# EAGLE design DRV8323RH (EAGLE 9.6.2)
AUTHOR: LYLES, LUNA, CARBAUGH; BOARD_NAME: BLDC Motor Driver; DOC_NUM: 1; PROJECT_NAME: Balancing Cube; REVISION: 2
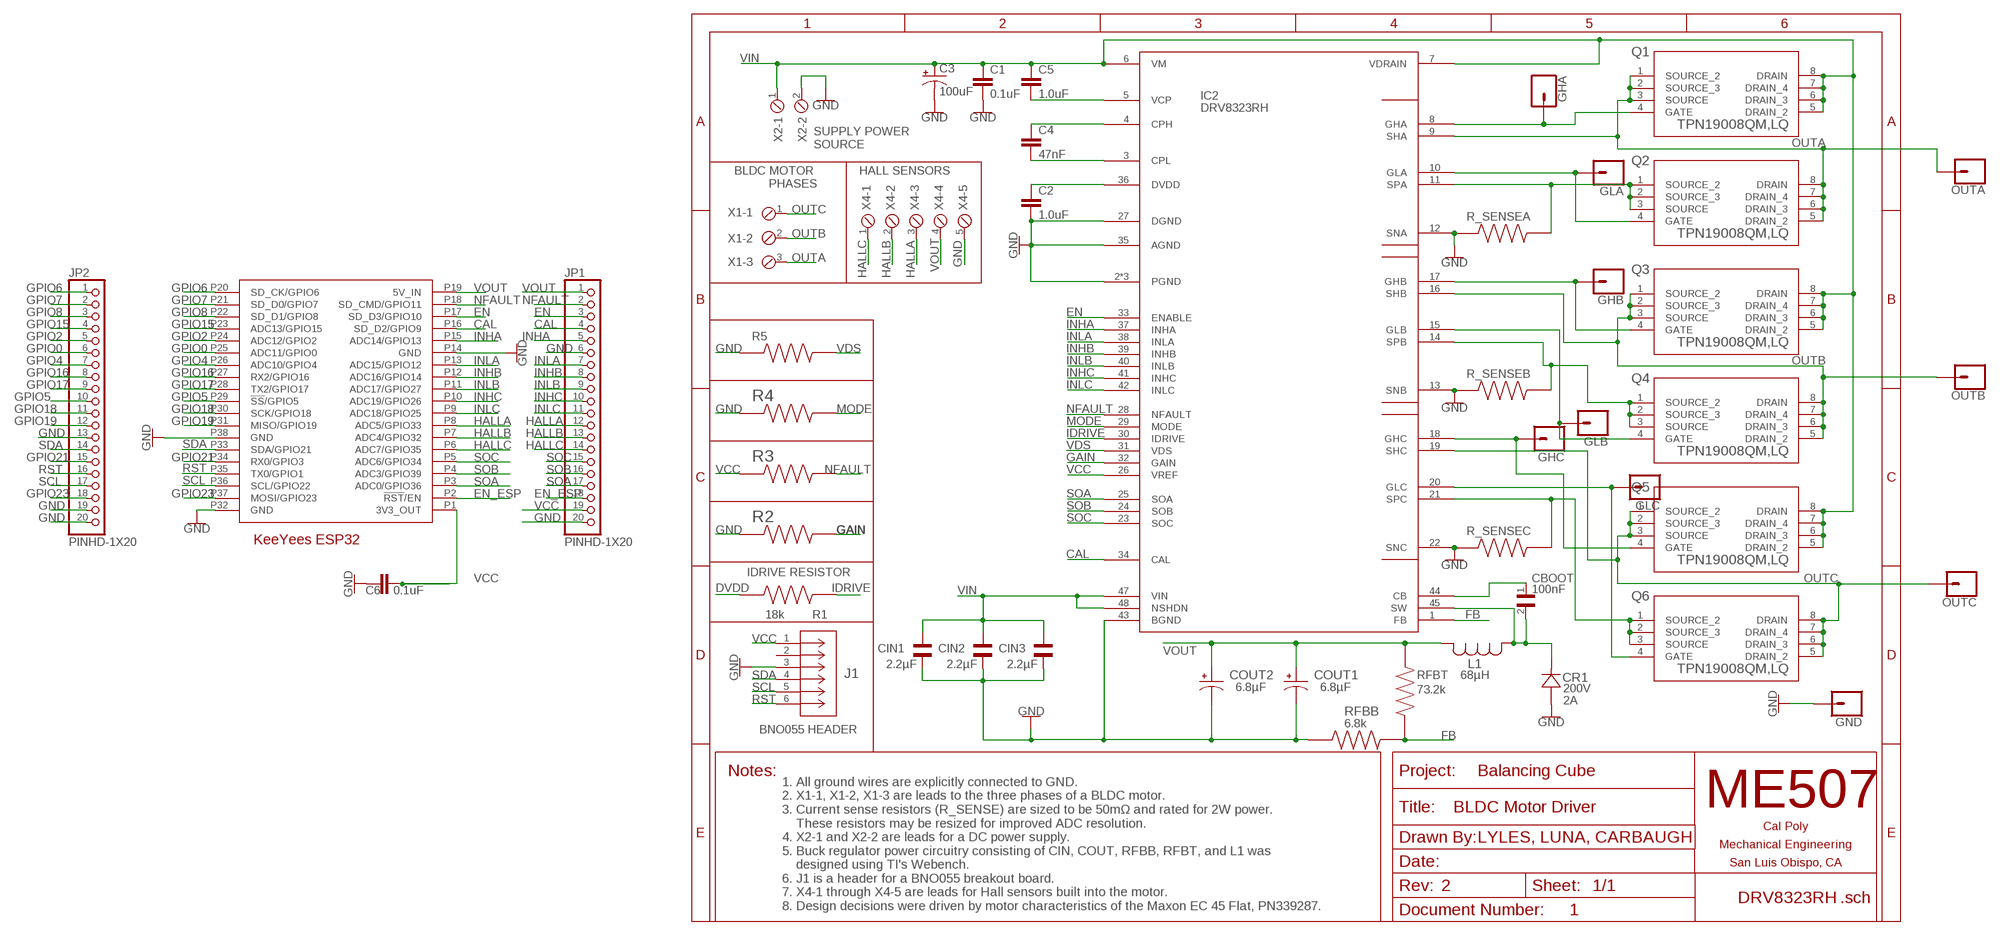
[diagram p0: schematic, sheet 1]

## Parts
C1  0.1uF  0.1UF-0603-50V-10%-X7R-WE  [0603]
C2  1.0uF  1.0UF-0805-25V-10%  [0805]
C3  100uF  100UF-POLAR-RADIAL-2.5MM-25V-20%  [CPOL-RADIAL-2.5MM-6.5MM]
C4  47nF  47NF-0603-25V-5%  [0603]
C5  1.0uF  1.0UF-0805-25V-10%  [0805]
C6  0.1uF  0.1UF-0603-50V-10%-X7R-WE  [0603]
CBOOT  C2012X7R2A104K125AA  [CAPC2012X145N]
CIN1  C3225X7R2A225K230AB  [CAP_C3225X7R2A225K230AB]
CIN2  C3225X7R2A225K230AB  [CAP_C3225X7R2A225K230AB]
CIN3  C3225X7R2A225K230AB  [CAP_C3225X7R2A225K230AB]
COUT1  TPSD685K050R0600  [CAPPM7343X310N]
COUT2  TPSD685K050R0600  [CAPPM7343X310N]
CR1  SK220ATRDIODE_SK220ATR_SMC-L  [DIODE_SK220ATR_SMC-L]
GHA  CONN_01_1MM  [1X01_1MM_NO_SILK]
GHB  CONN_01_1MM  [1X01_1MM_NO_SILK]
GHC  CONN_01_1MM  [1X01_1MM_NO_SILK]
GLA  CONN_01_1MM  [1X01_1MM_NO_SILK]
GLB  CONN_01_1MM  [1X01_1MM_NO_SILK]
GLC  CONN_01_1MM  [1X01_1MM_NO_SILK]
GND  CONN_01_1MM  [1X01_1MM_NO_SILK]
IC2  DRV8323RH  [QFN50P700X700X100-49T515]
J1  PPTC061LFBN-RCCONN6_061LFBN-RC_SUL  [CONN6_061LFBN-RC_SUL]
JP1  PINHD-1X20  [1X20]
JP2  PINHD-1X20  [1X20]
L1  SRR1210-680MIND_BOURNS_SRR1210  [IND_BOURNS_SRR1210]
OUTA  CONN_01_1MM  [1X01_1MM_NO_SILK]
OUTB  CONN_01_1MM  [1X01_1MM_NO_SILK]
OUTC  CONN_01_1MM  [1X01_1MM_NO_SILK]
Q1  TPN19008QM,LQ  [TSON_ADVANCE_TOS]
Q2  TPN19008QM,LQ  [TSON_ADVANCE_TOS]
Q3  TPN19008QM,LQ  [TSON_ADVANCE_TOS]
Q4  TPN19008QM,LQ  [TSON_ADVANCE_TOS]
Q5  TPN19008QM,LQ  [TSON_ADVANCE_TOS]
Q6  TPN19008QM,LQ  [TSON_ADVANCE_TOS]
R1  ERJP06J183V  [RES_ERJP06J183V]
R2  RMCF0805JT750K  [RESC2012X65N]
R3  RC0805JR-0710KP  [RESC2012X60N]
R4  RNCF0805DTE47K0  [RESC2012X65N]
R5  ERJP06J183V  [RES_ERJP06J183V]
R_SENSEA  CRM2512-FX-R300ELF  [RESC6331X80N]
R_SENSEB  CRM2512-FX-R300ELF  [RESC6331X80N]
R_SENSEC  CRM2512-FX-R300ELF  [RESC6331X80N]
RFBB  RC1206FR-076K8L  [RESC3116X65N]
RFBT  RR1220P-7322-D-M  [RESC2012X50N]
U$1  KEEYEES_ESP32EXT  [KEEYEES_ESP32_EXTENDED]
X1  SCREWTERM_3P_508  [3POL508]
X2  SCREWTERM_2P_508  [2POL508]
X4  SCREWTERM_5P_508  [5POL508]

## Nets
CAL: IC2.34(CAL) JP1.4 U$1.P16(SD_D2/GPIO9)
DVDD: C2.1 IC2.36(DVDD) R1.1
EN: IC2.33(ENABLE) JP1.3 U$1.P17(SD_D3/GPIO10)
EN_ESP: JP1.18 U$1.P2(!RST!/EN)
FB: IC2.1(FB) RFBB.2 RFBT.1
GAIN: IC2.32(GAIN) R2.2
GHA: GHA.1 IC2.8(GHA) Q1.4(GATE)
GHB: GHB.1 IC2.17(GHB) Q3.4(GATE)
GHC: GHC.1 IC2.18(GHC) Q5.4(GATE)
GLA: GLA.1 IC2.10(GLA) Q2.4(GATE)
GLB: GLB.1 IC2.15(GLB) Q4.4(GATE)
GLC: GLC.1 IC2.20(GLC) Q6.4(GATE)
GND: C1.2 C2.2 C3.2(-) C6.2 CIN1.1 CIN2.1 CIN3.1 COUT1.2 COUT2.2 CR1.2 GND.1 IC2.2(PGND) IC2.12(SNA) IC2.13(SNB) IC2.22(SNC) IC2.27(DGND) IC2.35(AGND) IC2.43(BGND) IC2.46(PGND) IC2.49(PGND) J1.3 JP1.6 JP1.20 JP2.13 JP2.19 JP2.20 R2.1 R4.1 R5.1 R_SENSEA.1 R_SENSEB.1 R_SENSEC.1 RFBB.1 U$1.P14(GND) U$1.P32(GND) U$1.P38(GND) X2.2 X4.5
GPIO0: JP2.6 U$1.P25(ADC11/GPIO0)
GPIO2: JP2.5 U$1.P24(ADC12/GPIO2)
GPIO4: JP2.7 U$1.P26(ADC10/GPIO4)
GPIO5: JP2.10 U$1.P29(!SS!/GPIO5)
GPIO6: JP2.1 U$1.P20(SD_CK/GPIO6)
GPIO7: JP2.2 U$1.P21(SD_D0/GPIO7)
GPIO8: JP2.3 U$1.P22(SD_D1/GPIO8)
GPIO15: JP2.4 U$1.P23(ADC13/GPIO15)
GPIO16: JP2.8 U$1.P27(RX2/GPIO16)
GPIO17: JP2.9 U$1.P28(TX2/GPIO17)
GPIO18: JP2.11 U$1.P30(SCK/GPIO18)
GPIO19: JP2.12 U$1.P31(MISO/GPIO19)
GPIO21: JP2.15 U$1.P34(RX0/GPIO3)
GPIO23: JP2.18 U$1.P37(MOSI/GPIO23)
HALLA: JP1.12 U$1.P8(ADC5/GPIO33) X4.3
HALLB: JP1.13 U$1.P7(ADC4/GPIO32) X4.2
HALLC: JP1.14 U$1.P6(ADC7/GPIO35) X4.1
IDRIVE: IC2.30(IDRIVE) R1.2
INHA: IC2.37(INHA) JP1.5 U$1.P15(ADC14/GPIO13)
INHB: IC2.39(INHB) JP1.8 U$1.P12(ADC16/GPIO14)
INHC: IC2.41(INHC) JP1.10 U$1.P10(ADC19/GPIO26)
INLA: IC2.38(INLA) JP1.7 U$1.P13(ADC15/GPIO12)
INLB: IC2.40(INLB) JP1.9 U$1.P11(ADC17/GPIO27)
INLC: IC2.42(INLC) JP1.11 U$1.P9(ADC18/GPIO25)
MODE: IC2.29(MODE) R4.2
N$2: CBOOT.1 IC2.44(CB)
N$13: C4.1 IC2.4(CPH)
N$14: C4.2 IC2.3(CPL)
NFAULT: IC2.28(NFAULT) JP1.2 R3.2 U$1.P18(SD_CMD/GPIO11)
OUTA: IC2.9(SHA) OUTA.1 Q1.1(SOURCE_2) Q1.2(SOURCE_3) Q1.3(SOURCE) Q2.5(DRAIN_2) Q2.6(DRAIN_3) Q2.7(DRAIN_4) Q2.8(DRAIN) X1.3
OUTB: IC2.16(SHB) OUTB.1 Q3.1(SOURCE_2) Q3.2(SOURCE_3) Q3.3(SOURCE) Q4.5(DRAIN_2) Q4.6(DRAIN_3) Q4.7(DRAIN_4) Q4.8(DRAIN) X1.2
OUTC: IC2.19(SHC) OUTC.1 Q5.1(SOURCE_2) Q5.2(SOURCE_3) Q5.3(SOURCE) Q6.5(DRAIN_2) Q6.6(DRAIN_3) Q6.7(DRAIN_4) Q6.8(DRAIN) X1.1
RST: J1.6 JP2.16 U$1.P35(TX0/GPIO1)
SCL: J1.5 JP2.17 U$1.P36(SCL/GPIO22)
SDA: J1.4 JP2.14 U$1.P33(SDA/GPIO21)
SOA: IC2.25(SOA) JP1.17 U$1.P3(ADC0/GPIO36)
SOB: IC2.24(SOB) JP1.16 U$1.P4(ADC3/GPIO39)
SOC: IC2.23(SOC) JP1.15 U$1.P5(ADC6/GPIO34)
SPA: IC2.11(SPA) Q2.1(SOURCE_2) Q2.2(SOURCE_3) Q2.3(SOURCE) R_SENSEA.2
SPB: IC2.14(SPB) Q4.1(SOURCE_2) Q4.2(SOURCE_3) Q4.3(SOURCE) R_SENSEB.2
SPC: IC2.21(SPC) Q6.1(SOURCE_2) Q6.2(SOURCE_3) Q6.3(SOURCE) R_SENSEC.2
SW: CBOOT.2 CR1.1 IC2.45(SW) L1.2
VCC: C6.1 IC2.26(VREF) J1.1 JP1.19 R3.1 U$1.P1(3V3_OUT)
VCP: C5.2 IC2.5(VCP)
VDS: IC2.31(VDS) R5.2
VIN: C1.1 C3.1(+) C5.1 CIN1.2 CIN2.2 CIN3.2 IC2.6(VM) IC2.7(VDRAIN) IC2.47(VIN) IC2.48(NSHDN) Q1.5(DRAIN_2) Q1.6(DRAIN_3) Q1.7(DRAIN_4) Q1.8(DRAIN) Q3.5(DRAIN_2) Q3.6(DRAIN_3) Q3.7(DRAIN_4) Q3.8(DRAIN) Q5.5(DRAIN_2) Q5.6(DRAIN_3) Q5.7(DRAIN_4) Q5.8(DRAIN) X2.1
VOUT: COUT1.1 COUT2.1 JP1.1 L1.1 RFBT.2 U$1.P19(5V_IN) X4.4
Unconnected: J1.2

## Notes on the sheet
- SUPPLY POWER 
  SOURCE
- BLDC MOTOR 
  PHASES
- HALL SENSORS
- IDRIVE RESISTOR
- BNO055 HEADER
- 1. All ground wires are explicitly connected to GND.
  2. X1-1, X1-2, X1-3 are leads to the three phases of a BLDC motor.
  3. Current sense resistors (R_SENSE) are sized to be 50mΩ and rated for 2W power. 
      These resistors may be resized for improved ADC resolution.
  4. X2-1 and X2-2 are leads for a DC power supply.
  5. Buck regulator power circuitry consisting of CIN, COUT, RFBB, RFBT, and L1 was 
      designed using TI's Webench.
  6. J1 is a header for a BNO055 breakout board.
  7. X4-1 through X4-5 are leads for Hall sensors built into the motor.
  8. Design decisions were driven by motor characteristics of the Maxon EC 45 Flat, PN339287.

## Library data of the parts
C1 C6 = SparkFun-Capacitors:0.1UF: 0.1µF ceramic capacitors A capacitor is a passive two-terminal electrical component used to store electrical energy temporarily in an electric field.; PROD_ID: CAP-16523
C2 C5 = SparkFun-Capacitors:1.0UF: 1µF ceramic capacitors A capacitor is a passive two-terminal electrical component used to store electrical energy temporarily in an electric field.; PROD_ID: CAP-08064
C3 = SparkFun-Capacitors:100UF-POLAR: 100µF polarized capacitors A capacitor is a passive two-terminal electrical component used to store electrical energy temporarily in an electric field.; PROD_ID: CAP-08439
C4 = SparkFun-Capacitors:47NF: 47nF ceramic capacitors A capacitor is a passive two-terminal electrical component used to store electrical energy temporarily in an electric field.; PROD_ID: CAP-08605
CBOOT = C2012X7R2A104K125AA-2:C2012X7R2A104K125AA: 0.1µF ±10% 100V Ceramic Capacitor X7R 0805 (2012 Metric); DESCRIPTION: 0.1µF ±10% 100V Ceramic Capacitor X7R 0805 (2012 Metric); MF: TDK; MP: C2012X7R2A104K125AA; PACKAGE: 2012 TDK; PURCHASE-URL: https://pricing.snapeda.com/search/part/C2012X7R2A104K125AA/?ref=eda; VAL: 100nF
CIN1-CIN3 = C3225X7R2A225K230AB:C3225X7R2A225K230AB; DESCRIPTION: 2.2 µF ±10% 100V Ceramic Capacitor X7R 1210 (3225 Metric); MF: TDK; MP: C3225X7R2A225K230AB; PACKAGE: 3225-2 TDK; PURCHASE-URL: https://pricing.snapeda.com/search/part/C3225X7R2A225K230AB/?ref=eda; VAL: 2.2µF
COUT1 COUT2 = TPSD685K050R0600:TPSD685K050R0600; DESCRIPTION: Cap Tant Solid 6.8uF 50V D CASE 10% (7.3 X 4.3 X 2.9mm) Inward L SMD 7343-31 0.6 Ohm 125C T/R; DIGI-KEY_PART_NUMBER: 478-4121-2-ND; MF: AVX; MP: TPSD685K050R0600; PACKAGE: 2917 AVX; PURCHASE-URL: https://pricing.snapeda.com/search/part/TPSD685K050R0600/?ref=eda; VAL: 6.8µF
CR1 = 2022-10-21_00-14-24_Library:SK220ATR; COPYRIGHT: Copyright (C) 2022 Ultra Librarian. All rights reserved.; CURR: 2A; DIGI-KEY_PART_NUMBER_1: 1655-2135-1-ND; DIGI-KEY_PART_NUMBER_2: 1655-2135-2-ND; DIGI-KEY_PART_NUMBER_3: 1655-2135-6-ND; MANUFACTURER_PART_NUMBER: SK220ATR; MFR_NAME: SMC Diode Solutions; VOLT: 200V
GHA GHB GHC GLA GLB GLC GND OUTA OUTB OUTC = SparkFun-Connectors:CONN_01: Single connection point. Often used as Generic Header-pin footprint for 0.1 inch spaced/style header connections On any of the 0.1 inch spaced packages, you can populate with these: Break Away Headers - Straight <https://www.sparkfun.com/products/116> (PRT-00116) Break Away Male Headers - Right Angle <https://www.sparkfun.com/products/553> (PRT-00553) Female Headers <https://www.sparkfun.com/products/115> (PRT-00115) Break Away Headers - Machine Pin <https://www.sparkfun.com/products/117> (PRT-00117) Break Away Female Headers - Swiss Machine Pin <https://www.sparkfun.com/products/743> (PRT-00743) This device is also useful as a general connection point to wire up your design to another part of your project. Our various solder wires solder well into these plated through hole pads. Hook-Up Wire - Assortment (Stranded, 22 AWG) <https://www.sparkfun.com/products/11375> (PRT-11375) Hook-Up Wire - Assortment (Solid Core, 22 AWG) <https://www.sparkfun.com/products/11367> (PRT-11367) View the entire wire category on our website here <https://www.sparkfun.com/categories/141> Special notes: SMTSO-256-ET is a "flush mount" nut for a 4-40 screw. We mostly use this on specialty testbeds; it is a nice way to connect hardware to your PCB at an adjustable hieght. Also note, the SNAP packages are for using a snappable style connector. We sell a baggie of snaps and they are also used on two LilyPad designs: Snap Assortment - 30 pack (male and female) <https://www.sparkfun.com/products/11347> (DEV-11347) LilyPad Arduino SimpleSnap <https://www.sparkfun.com/products/10941> (DEV-10941) LilyPad SimpleSnap Protoboard <https://www.sparkfun.com/products/10940> (DEV-10940)
IC2 = texas_instruments:DRV8323RH
J1 = 2022-10-25_05-37-55_Library:PPTC061LFBN-RC; COPYRIGHT: Copyright (C) 2022 Ultra Librarian. All rights reserved.; DIGI-KEY_PART_NUMBER_1: S7004-ND; MANUFACTURER_PART_NUMBER: PPTC061LFBN-RC; MFR_NAME: Sullins
JP1 JP2 = Connector:PINHD-1X20: PIN HEADER; CATEGORY: CONNECTOR; SUB-CATEGORY: PIN-HEADER
L1 = 2022-10-23_07-45-30_Library:SRR1210-680M; COPYRIGHT: Copyright (C) 2022 Ultra Librarian. All rights reserved.; DIGI-KEY_PART_NUMBER_1: SRR1210-680MCT-ND; DIGI-KEY_PART_NUMBER_2: SRR1210-680MDKR-ND; DIGI-KEY_PART_NUMBER_3: SRR1210-680MTR-ND; MANUFACTURER_PART_NUMBER: SRR1210-680M; MFR_NAME: Bourns Electronics; VAL: 68µH
Q1-Q6 = TPN19008QM_LQ:TPN19008QM,LQ; COPYRIGHT: Copyright (C) 2022 Ultra Librarian. All rights reserved.; DIGI-KEY_PART_NUMBER_1: 264-TPN19008QMLQTR-ND; DIGI-KEY_PART_NUMBER_2: 264-TPN19008QMLQCT-ND; DIGI-KEY_PART_NUMBER_3: 264-TPN19008QMLQDKR-ND; MANUFACTURER_PART_NUMBER: TPN19008QM,LQ; MFR_NAME: Toshiba Electronic Devices & Storage Corp.
R1 = ERJP06J183V:ERJP06J183V; DESCRIPTION: 18 kOhms ±5% 0.5W, 1/2W Chip Resistor 0805 (2012 Metric) Automotive AEC-Q200, Pulse Withstanding Thick Film; DIGI-KEY_PART_NUMBER: P18KADTR-ND; MF: Panasonic; MP: ERJP06J183V; NAM: R1; PACKAGE: 2012-2 Panasonic; PURCHASE-URL: https://pricing.snapeda.com/search/part/ERJP06J183V/?ref=eda; VAL: 18k
R2 = RMCF0805JT750K:RMCF0805JT750K; DESCRIPTION: 750 kOhms ±5% 0.125W, 1/8W Chip Resistor 0805 (2012 Metric) Automotive AEC-Q200 Thick Film; DIGI-KEY_PART_NUMBER: RMCF0805JT750KTR-ND; MF: Stackpole Electronics Inc; MP: RMCF0805JT750K; PACKAGE: 2012 Stackpole; PURCHASE-URL: https://pricing.snapeda.com/search/part/RMCF0805JT750K/?ref=eda
R3 = RC0805JR-0710KP:RC0805JR-0710KP; DESCRIPTION: 10 kOhms ±5% 0.125W, 1/8W Chip Resistor 0805 (2012 Metric) Moisture Resistant Thick Film; DIGI-KEY_PART_NUMBER: YAG1329TR-ND; MF: Yageo; MP: RC0805JR-0710KP; PACKAGE: 2012 Rohm Semiconductor; PURCHASE-URL: https://pricing.snapeda.com/search/part/RC0805JR-0710KP/?ref=eda
R4 = RNCF0805DTE47K0:RNCF0805DTE47K0; DESCRIPTION: 47 kOhms ±0.5% 0.125W, 1/8W Chip Resistor 0805 (2012 Metric) Automotive AEC-Q200 Thin Film; DIGI-KEY_PART_NUMBER: 738-RNCF0805DTE47K0TR-ND; MF: Stackpole Electronics Inc; MP: RNCF0805DTE47K0; PACKAGE: 2012 Stackpole; PURCHASE-URL: https://pricing.snapeda.com/search/part/RNCF0805DTE47K0/?ref=eda
R5 = ERJP06J183V:ERJP06J183V; DESCRIPTION: 18 kOhms ±5% 0.5W, 1/2W Chip Resistor 0805 (2012 Metric) Automotive AEC-Q200, Pulse Withstanding Thick Film; DIGI-KEY_PART_NUMBER: P18KADTR-ND; MF: Panasonic; MP: ERJP06J183V; PACKAGE: 2012-2 Panasonic; PURCHASE-URL: https://pricing.snapeda.com/search/part/ERJP06J183V/?ref=eda
R_SENSEA = CRM2512-FX-R300ELF:CRM2512-FX-R300ELF: ResHighPower 2512 R300 1% 2W TC100; DESCRIPTION: 300 mOhms ±1% 2W Chip Resistor 2512 (6432 Metric) Current Sense Thick Film; DIGI-KEY_PART_NUMBER: CRM2512-FX-R300ELFTR-ND; MF: Bourns; MP: CRM2512-FX-R300ELF; PACKAGE: 6331 Bourns; PURCHASE-URL: https://pricing.snapeda.com/search/part/CRM2512-FX-R300ELF/?ref=eda; VAL: 0.305
R_SENSEB R_SENSEC = CRM2512-FX-R300ELF:CRM2512-FX-R300ELF: ResHighPower 2512 R300 1% 2W TC100; DESCRIPTION: 300 mOhms ±1% 2W Chip Resistor 2512 (6432 Metric) Current Sense Thick Film; DIGI-KEY_PART_NUMBER: CRM2512-FX-R300ELFTR-ND; MF: Bourns; MP: CRM2512-FX-R300ELF; PACKAGE: 6331 Bourns; PURCHASE-URL: https://pricing.snapeda.com/search/part/CRM2512-FX-R300ELF/?ref=eda
RFBB = RC1206FR-076K8L:RC1206FR-076K8L: Res Thick Film 3.2 x 1.6 mm 6.8K Ohm 1% 0.25W(1/4W) 100ppm/ C Molded SMD Paper T/R; DESCRIPTION: 6.8 kOhms ±1% 0.25W, 1/4W Chip Resistor 1206 (3216 Metric) Moisture Resistant Thick Film; DIGI-KEY_PART_NUMBER: 311-6.80KFRTR-ND; MF: Yageo; MP: RC1206FR-076K8L; PACKAGE: 3116 Yageo; PURCHASE-URL: https://pricing.snapeda.com/search/part/RC1206FR-076K8L/?ref=eda; VAL: 6.8k
RFBT = RR1220P-7322-D-M:RR1220P-7322-D-M; DESCRIPTION: 73.2 kOhms ±0.5% 0.1W, 1/10W Chip Resistor 0805 (2012 Metric) - Thin Film; DIGI-KEY_PART_NUMBER: RR12P73.2KDTR-ND; MF: Susumu; MP: RR1220P-7322-D-M; PACKAGE: 2012 TE Connectivity; PURCHASE-URL: https://pricing.snapeda.com/search/part/RR1220P-7322-D-M/?ref=eda; VAL: 73.2k
U$1 = ME507:KEEYEES_ESP32: Footprint for an add-on board (shield, hat, etc.) for a KeeYees ESP32 development board with ESP-WROOM-32 module. 38 pins.
X1 = ME507:SCREWTERM_3P: Screw Terminal Block This part is designed for a screw terminal connector. The 2.54mm (0.100 inch) foorprint can also be used for male or female pin headers such as those on most development boards. One can also solder wires directly into the holes, though this makes modifications or repairs to the system more inconvenient. Larger versions can carry more current.
X2 = ME507:SCREWTERM_2P: Screw Terminal Block This part is designed for a screw terminal connector. The 2.54mm (0.100 inch) foorprint can also be used for male or female pin headers such as those on most development boards. One can also solder wires directly into the holes, though this makes modifications or repairs to the system more inconvenient. Larger versions can carry more current.
X4 = ME507:SCREWTERM_5P: Screw Terminal Block This part is designed for a screw terminal connector. The 2.54mm (0.100 inch) foorprint can also be used for male or female pin headers such as those on most development boards. One can also solder wires directly into the holes, though this makes modifications or repairs to the system more inconvenient. Larger versions can carry more current.

## Board
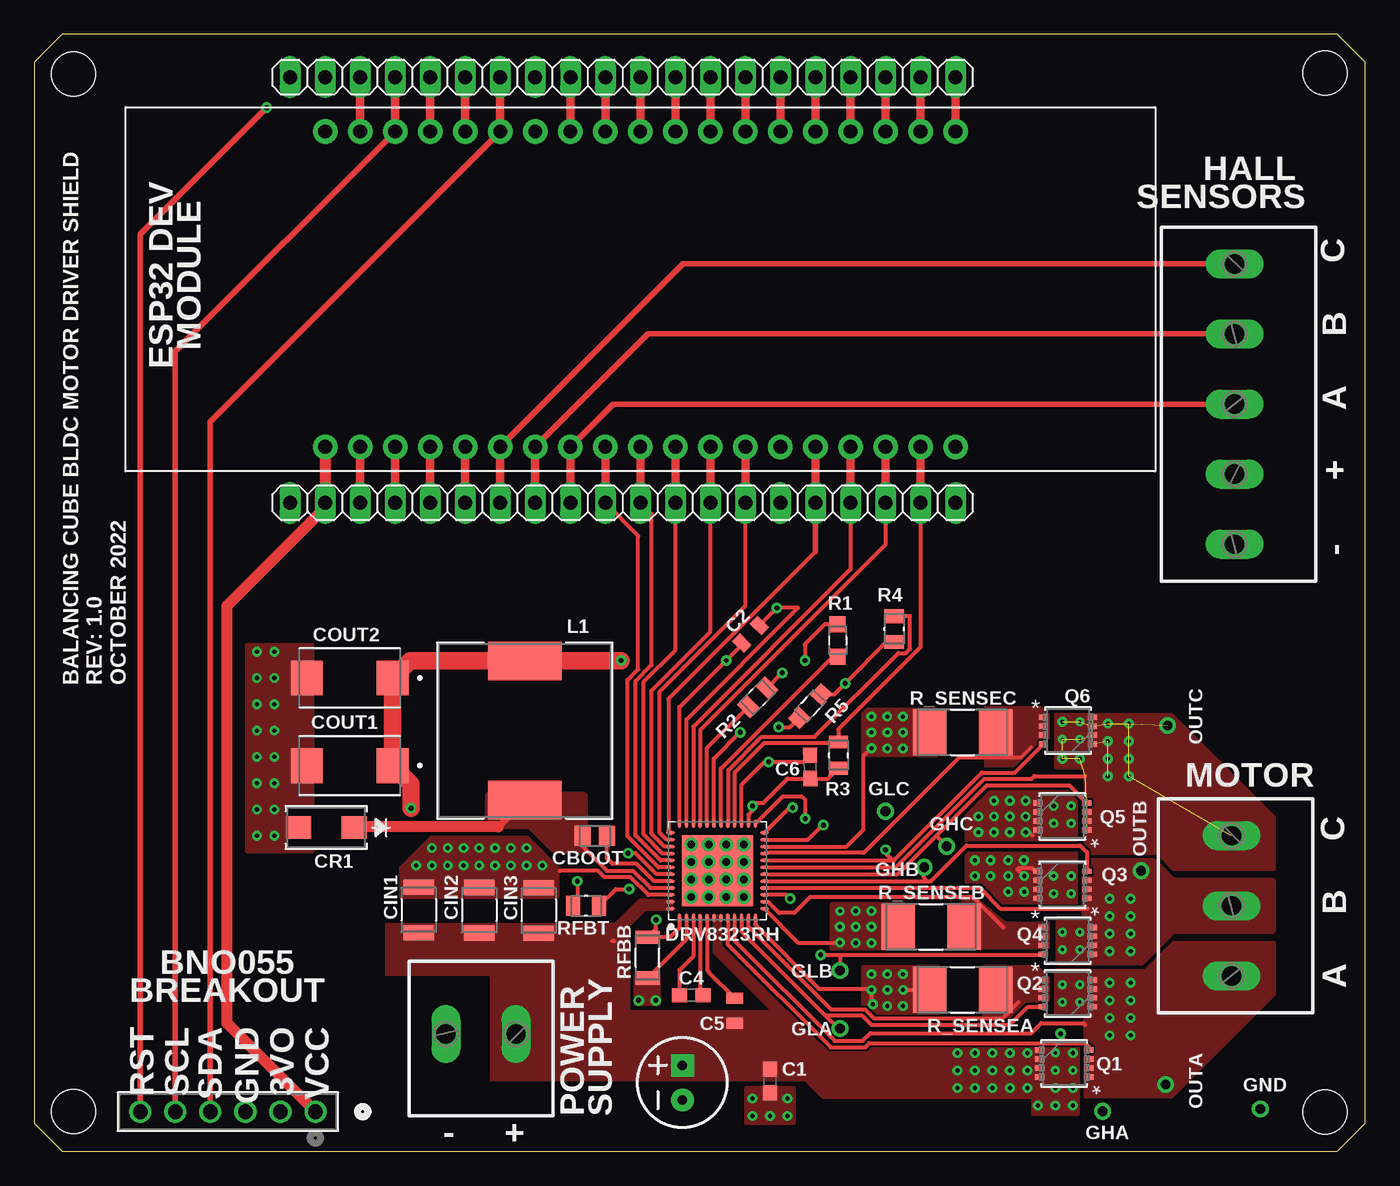
[diagram p1: board, top side]
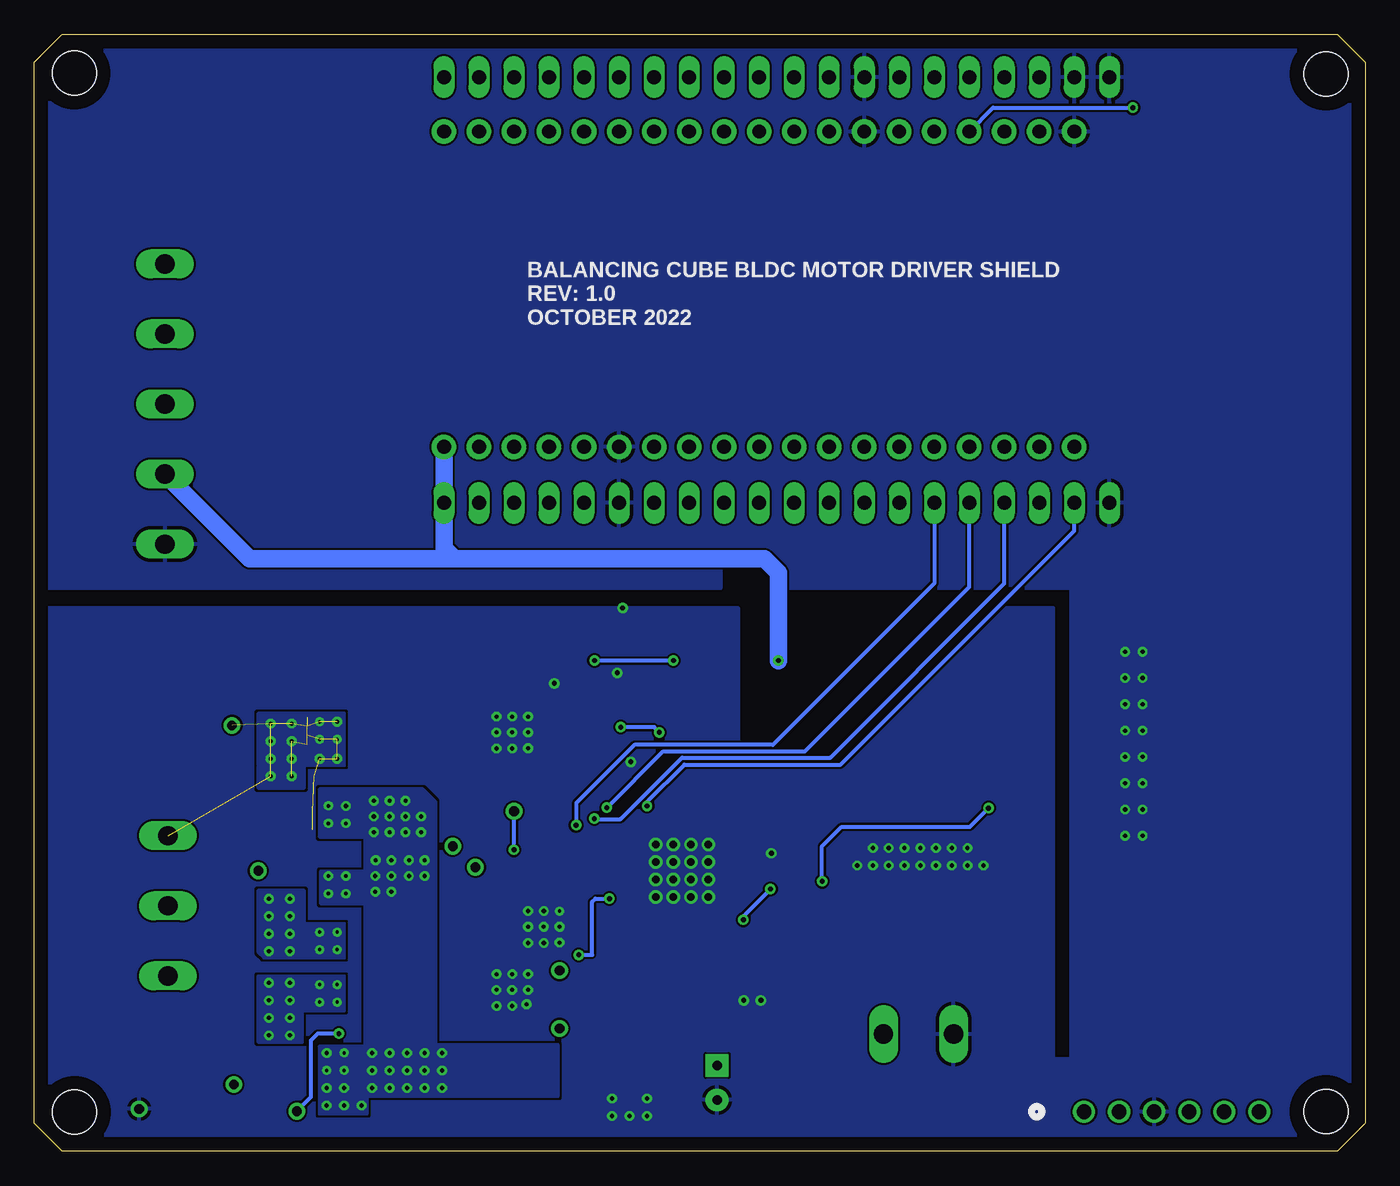
[diagram p2: board, bottom side, seen from below]

Size 96.5 x 80.95 mm. Coordinates in mm from the lower left corner, seen from the top.
Outline: 96.5,2 96.5,78.95 94.5,80.95 2,80.95 0,78.95 0,2 2,0 94.5,0 96.5,2
Copper layers (1*16): Top 0.035mm / dielectric 1.5mm / Bottom 0.035mm
Design rules "default *": minimum track width 6mil, minimum drill 0.35mm, track to track 6mil, track to pad 6mil, pad to pad 6mil, via to via 6mil, smd to smd 6mil, copper to edge 40mil, drill to drill 6mil, minimum pad ring 10mil, minimum via ring 8mil, stop-mask expansion 4mil, vias tented up to drill 12mil, thermal gap 10mil
Holes 3.2 mm at 2.83,78.08 93.61,78.14 2.84,2.86 93.59,2.81

### Footprints (pad centres in the part's own frame; a part is rotated, then mirrored left to right if it is on the bottom)
0603 = smd 1.1 x 1: 1 -0.85,0; 2 0.85,0
0805 = smd 0.8 x 1.2: 1 -0.9,0; 2 0.9,0
CPOL-RADIAL-2.5MM-6.5MM = drill 0.7 pad 1.651 square: 1 1.25,0 | drill 0.7 pad 1.651: 2 -1.25,0
CAPC2012X145N = smd 1.15 x 1.47: 1 -0.88,0; 2 0.88,0
CAP_C3225X7R2A225K230AB = smd 1.1 x 2.2: 1 -1.65,0; 2 1.65,0
CAPPM7343X310N = smd 2.3 x 2.52: 1 -3.11,0; 2 3.11,0
DIODE_SK220ATR_SMC-L = smd 1.803 x 1.651: 1 -2.007,0; 2 2.007,0
1X01_1MM_NO_SILK = drill 0.7 pad 1.2: 1 0,0
QFN50P700X700X100-49T515 = smd 0.6 x 0.24: 1 -3.4,2.75; 2 -3.4,2.25; 3 -3.4,1.75; 4 -3.4,1.25; 5 -3.4,0.75; 6 -3.4,0.25; 7 -3.4,-0.25; 8 -3.4,-0.75; 9 -3.4,-1.25; 10 -3.4,-1.75; 11 -3.4,-2.25; 12 -3.4,-2.75; 25 3.4,-2.75; 26 3.4,-2.25; 27 3.4,-1.75; 28 3.4,-1.25; 29 3.4,-0.75; 30 3.4,-0.25; 31 3.4,0.25; 32 3.4,0.75; 33 3.4,1.25; 34 3.4,1.75; 35 3.4,2.25; 36 3.4,2.75 | smd 0.24 x 0.6: 13 -2.75,-3.4; 14 -2.25,-3.4; 15 -1.75,-3.4; 16 -1.25,-3.4; 17 -0.75,-3.4; 18 -0.25,-3.4; 19 0.25,-3.4; 20 0.75,-3.4; 21 1.25,-3.4; 22 1.75,-3.4; 23 2.25,-3.4; 24 2.75,-3.4; 37 2.75,3.4; 38 2.25,3.4; 39 1.75,3.4; 40 1.25,3.4; 41 0.75,3.4; 42 0.25,3.4; 43 -0.25,3.4; 44 -0.75,3.4; 45 -1.25,3.4; 46 -1.75,3.4; 47 -2.25,3.4; 48 -2.75,3.4 | smd 5.15 x 5.15: 49 0,0
CONN6_061LFBN-RC_SUL = drill 1.067 pad 1.321: 1 0,0; 2 2.54,0; 3 5.08,0; 4 7.62,0; 5 10.16,0; 6 12.7,0
1X20 = drill 1.016 long: 1 -24.13,0; 2 -21.59,0; 3 -19.05,0; 4 -16.51,0; 5 -13.97,0; 6 -11.43,0; 7 -8.89,0; 8 -6.35,0; 9 -3.81,0; 10 -1.27,0; 11 1.27,0; 12 3.81,0; 13 6.35,0; 14 8.89,0; 15 11.43,0; 16 13.97,0; 17 16.51,0; 18 19.05,0; 19 21.59,0; 20 24.13,0
IND_BOURNS_SRR1210 = smd 2.794 x 5.309: 1 -5.042,0; 2 5.042,0
TSON_ADVANCE_TOS = smd 0.66 x 0.381: 1 -1.778,0.975; 2 -1.778,0.325; 3 -1.778,-0.325; 4 -1.778,-0.975; 5 1.778,-0.975; 6 1.778,-0.325; 7 1.778,0.325; 8 1.778,0.975
RES_ERJP06J183V = smd 1.15 x 1.15: 1 -1.175,0; 2 1.175,0
RESC2012X65N = smd 1.01 x 1.38: 1 -0.95,0; 2 0.95,0
RESC2012X60N = smd 0.92 x 1.38: 1 -0.955,0; 2 0.955,0
RESC2012X65N' = smd 1 x 1.42: 1 -0.935,0; 2 0.935,0
RESC6331X80N = smd 2.44 x 3.32: 1 -2.39,0; 2 2.39,0
RESC3116X65N = smd 0.97 x 1.73: 1 -1.48,0; 2 1.48,0
RESC2012X50N = smd 1.04 x 1.47: 1 -0.94,0; 2 0.94,0
KEEYEES_ESP32_EXTENDED = drill 1 pad 1.778: P1 -11.43,21.59; P2 -11.43,19.05; P3 -11.43,16.51; P4 -11.43,13.97; P5 -11.43,11.43; P6 -11.43,8.89; P7 -11.43,6.35; P8 -11.43,3.81; P9 -11.43,1.27; P10 -11.43,-1.27; P11 -11.43,-3.81; P12 -11.43,-6.35; P13 -11.43,-8.89; P14 -11.43,-11.43; P15 -11.43,-13.97; P16 -11.43,-16.51; P17 -11.43,-19.05; P18 -11.43,-21.59; P19 -11.43,-24.13; P20 11.43,-24.13; P21 11.43,-21.59; P22 11.43,-19.05; P23 11.43,-16.51; P24 11.43,-13.97; P25 11.43,-11.43; P26 11.43,-8.89; P27 11.43,-6.35; P28 11.43,-3.81; P29 11.43,-1.27; P30 11.43,1.27; P31 11.43,3.81; P32 11.43,6.35; P33 11.43,8.89; P34 11.43,11.43; P35 11.43,13.97; P36 11.43,16.51; P37 11.43,19.05; P38 11.43,21.59
3POL508 = drill 1.4 long: 1 -5.08,0; 2 0,0; 3 5.08,0
2POL508 = drill 1.4 long: 1 -2.54,0; 2 2.54,0
5POL508 = drill 1.4 long: 1 -10.16,0; 2 -5.08,0; 3 0,0; 4 5.08,0; 5 10.16,0

### Placement (x,y rotation side)
C1  53.34,5.08 270 top
C2  51.94,37.47 45 top
C3  46.99,4.95 90 top
C4  47.62,11.3 180 top
C5  50.8,10.16 90 top
C6  56.26,27.86 90.5 top
CBOOT  40.64,22.86 180 top
CIN1  27.87,17.48 270 top
CIN2  32.26,17.46 270 top
CIN3  36.58,17.44 270 top
COUT1  22.86,27.94 180 top
COUT2  22.86,34.29 180 top
CR1  21.16,23.45 180 top
GHA  77.47,2.89 0 top
GHB  64.52,20.57 0 top
GHC  66.17,22.09 0 top
GLA  58.42,8.89 0 top
GLB  58.42,13.08 0 top
GLC  61.72,24.64 0 top
GND  88.9,3.05 0 top
IC2  49.53,20.32 90 top
J1  20.38,2.85 180 top
JP1  42.67,46.99 180 top
JP2  42.67,77.85 180 top
L1  35.56,30.48 270 top
OUTA  82.04,4.83 0 top
OUTB  80.26,20.32 0 top
OUTC  82.17,30.86 0 top
Q1  74.68,6.35 180 top
Q2  74.93,11.43 0 top
Q3  74.55,19.3 180 top
Q4  74.93,15.24 0 top
Q5  74.55,24.26 180 top
Q6  74.96,30.48 0 top
R1  58.25,37.02 270.1 top
R2  52.45,32.89 225 top
R3  58.3,28.7 90 top
R4  RNCF0805DTE47K0  [RESC2012X65N']  62.36,37.85 90 top
R5  56.26,32.26 226.9 top
R_SENSEA  67.31,11.68 0 top
R_SENSEB  65.02,16.26 0 top
R_SENSEC  67.31,30.35 0 top
RFBB  44.45,14.02 90 top
RFBT  40.01,17.78 180 top
U$1  42.67,62.48 90 top
X1  86.81,17.78 270 top
X2  32.38,8.48 180 top
X4  87.03,54.16 270 top

### Tracks (layer width: path | path; a pad name or v marks a point on that pad's centre or on a via)
CAL
  Top 0.305: IC2.34 47.78,30.77 59.18,42.18 JP1.4
  Top 0.61: U$1.P16 JP1.4
DVDD  (via drill 0.35)
  Top 0.305: IC2.36 46.78,32.17 v50.16,35.56 51.31,36.7 C2.1 | R1.1 57.34,38.19 55.88,36.73 v55.88,35.56
  Bottom 0.305: v50.16,35.56 v55.88,35.56
EN
  Top 0.305: JP1.3 61.72,43.96 48.28,30.52 IC2.33
  Top 0.61: U$1.P17 JP1.3
EN_ESP
  Top 0.61: U$1.P2 JP1.18
FB  (via drill 0.35)
  Top 0.305: IC2.1 46.78,16.17 46.1,15.5 RFBB.2 45.09,16.13 v45.09,16.77 | RFBT.1 42.16,19 v43.12,19
  Bottom 0.305: v45.09,16.77 45.09,17.04 v43.12,19
GAIN
  Top 0.305: IC2.32 48.78,29.22 R2.2
GHA  (via drill 0.35)
  Top 0.305: IC2.8 50.28,15.48 50.27,15.47 50.27,15.01 57.75,7.52 60.26,7.52 60.55,7.82 74.93,7.82 | Q1.4 76.45,7.58 76.21,7.82 74.93,7.82 | 74.93,7.82 74.42,8.33 v74.42,8.51
  Bottom 0.305: v74.42,8.51 75.95,8.51 76.45,8 76.45,3.91 GHA.1
GHB
  Top 0.305: IC2.17 64.77,19.57 | 64.77,19.57 65.01,19.57 67.59,22.15 75.85,22.15 76.33,21.66 Q3.4 | 64.77,19.57 64.52,19.82 GHB.1
GHC
  Top 0.305: 65.41,22.85 62.63,20.07 IC2.18 | 65.41,22.85 69.07,26.52 75.04,26.52 Q5.4 | 65.41,22.85 GHC.1
GLA
  Top 0.305: IC2.10 51.28,15.9 57.09,10.1 57.38,9.8 | Q2.4 72.06,10.45 70.75,9.15 60.72,9.15 60.07,9.8 57.38,9.8 | 57.38,9.8 58.29,8.89 GLA.1
GLB  (via drill 0.35)
  Top 0.305: v57.02,14.22 58.42,14.22 | 58.42,14.22 73.11,14.22 Q4.4 | v54.8,18.3 54.53,18.57 IC2.15 | 58.42,14.22 GLB.1
  Bottom 0.305: v57.02,14.22 56.05,14.22 56.05,18.07 55.82,18.3 v54.8,18.3
GLC  (via drill 0.35)
  Top 0.305: IC2.20 62.23,21.07 | 62.23,21.07 62.33,21.07 68.69,27.43 71.11,27.43 Q6.4 | 62.23,21.07 61.72,21.58 v61.72,21.84
  Bottom 0.305: v61.72,21.84 GLC.1
GND  (via drill 0.25, 0.3, 0.35, 0.55)
  Top 0.305: RFBB.1 47.28,15.37 IC2.2 | IC2.12 52.28,16.41 56.91,11.78 60.68,11.78 60.71,11.75 60.71,10.74 v60.8,10.64 | v43.05,21.59 43.6,21.59 45.12,20.07 IC2.43 | v63,11.68 R_SENSEA.1 | v58.42,15.11 58.39,15.08 55.42,15.08 IC2.13 | IC2.22 58.9,22.07 60.14,23.31 60.14,28.64 v60.71,29.21 | IC2.27 51.28,26.57 52.93,28.22 v53.25,28.22 | 38.1,20.32 40.87,20.32 41.33,19.86 43.22,19.86 44.52,18.57 IC2.46 | C2.2 v53.85,39.37 55.38,39.37 47.28,31.27 IC2.35 | v53.25,28.22 v53.24,28.21 | v53.25,28.22 55.77,28.22 C6.2 | v54.23,34.67 R2.1 | R4.1 61.8,36.91 v58.8,33.91 58.01,33.12 R5.1
  other vias: 54.61,3.81 52.07,3.81 54.61,2.54 53.34,2.54 52.07,2.54 43.81,10.92 33.4,20.7 31.12,20.7 29.97,20.7 28.83,20.7 27.69,20.7 34.54,20.7 35.69,20.7 36.83,20.7 28.83,21.97 29.97,21.97 32.26,21.97 31.12,21.97 33.4,21.97 34.54,21.97 35.69,21.97 16.13,36.19 17.4,36.19 17.4,34.29 16.13,34.29 17.4,32.39 16.13,32.39 16.13,30.48 17.4,30.48 16.13,28.57 17.4,28.57 16.13,26.67 17.4,26.67 16.13,24.76 17.4,24.76 16.13,22.86 17.4,22.86 61.85,10.51 61.85,12.83 32.26,20.7 61.85,11.68 60.71,11.68 60.71,12.83 62.99,10.51 62.99,12.83 59.56,15.08 59.56,17.4 59.57,16.26 58.42,16.26 60.71,15.08 60.71,17.4 60.71,16.26 58.42,17.4 61.85,29.18 61.85,31.5 61.85,30.35 60.71,30.35 62.99,29.18 62.99,31.5 63,30.35 60.71,31.5 51.44,18.41 51.44,19.68 51.44,20.95 51.44,22.22 50.16,18.41 50.16,19.68 50.16,20.95 50.16,22.22 48.9,22.22 47.62,22.22 47.62,20.95 48.9,20.95 48.9,19.68 48.9,18.41 47.62,18.41 47.62,19.68 45.06,10.92
  pour Bottom (rank 5): -3.66,40.79 46.84,40.79 46.84,84.94 -3.66,84.94
  pour Top (no thermals): 51.59,2.06 55.09,2.06 55.09,4.55 51.59,4.55
  pour Top (no thermals): 43.59,10.69 45.31,10.69 45.31,12.67 43.59,12.67
  pour Top (no thermals): 26.57,18.44 37.95,18.44 37.95,20.51 35.75,22.71 28.77,22.71 26.57,20.51
  pour Top (no thermals): 15.39,21.74 20.17,21.74 20.17,36.68 15.39,36.68
  pour Top (no thermals): 60.1,10.06 65.63,10.06 65.63,13.31 60.1,13.31
  pour Bottom (rank 5): -3.66,-3.66 23.72,-3.66 23.72,6.71 -3.66,6.71
  pour Bottom (rank 5): 22.63,-3.66 45.57,-3.66 45.57,39.37 22.63,39.37
  pour Bottom (rank 5): -3.66,5.99 21.31,5.99 21.31,48.11 -3.66,48.11
  pour Top (no thermals): 57.81,14.63 63.09,14.63 63.09,17.88 57.81,17.88
  pour Top (no thermals): 60.1,28.73 65.38,28.73 65.38,31.98 60.1,31.98
  pour Top: 47.14,17.93 51.92,17.93 51.92,22.71 47.14,22.71
  pour Bottom (rank 5): 45.49,-3.66 100.18,-3.66 100.18,39.37 45.49,39.37
  pour Bottom (rank 5): 46.76,40.79 100.18,40.79 100.18,84.91 46.76,84.91
GPIO0
  Top 0.61: U$1.P25 JP2.6
GPIO2
  Top 0.61: U$1.P24 JP2.5
GPIO4
  Top 0.61: U$1.P26 JP2.7
GPIO5
  Top 0.61: U$1.P29 JP2.10
GPIO6
  Top 0.61: U$1.P20 JP2.1
GPIO7
  Top 0.61: U$1.P21 JP2.2
GPIO8
  Top 0.61: U$1.P22 JP2.3
GPIO15
  Top 0.61: U$1.P23 JP2.4
GPIO16
  Top 0.61: U$1.P27 JP2.8
GPIO17
  Top 0.61: U$1.P28 JP2.9
GPIO18
  Top 0.61: U$1.P30 JP2.11
GPIO19
  Top 0.61: U$1.P31 JP2.12
GPIO21
  Top 0.61: U$1.P34 JP2.15
GPIO23
  Top 0.61: U$1.P37 JP2.18
HALLA
  Top 0.406: U$1.P8 41.96,54.16 X4.3
  Top 0.61: U$1.P8 JP1.12
HALLB
  Top 0.406: X4.2 44.5,59.24 U$1.P7
  Top 0.61: U$1.P7 JP1.13
HALLC
  Top 0.406: X4.1 47.04,64.32 U$1.P6
  Top 0.61: U$1.P6 JP1.14
IDRIVE
  Top 0.305: IC2.30 49.78,27.72 57.9,35.84 R1.2
INHA
  Top 0.305: IC2.37 45.97,23.23 45.97,32.79 56.64,43.46
  Top 0.406: JP1.5 56.64,43.46
  Top 0.61: U$1.P15 JP1.5
INHB
  Top 0.305: IC2.39 45.7,22.07 44.76,23.01 44.76,33.37 49.02,37.64 JP1.8
  Top 0.61: U$1.P12 JP1.8
INHC
  Top 0.305: IC2.41 45.41,21.07 43.59,22.89 43.59,34.08 44.76,35.24 44.76,46.18 JP1.10
  Top 0.61: JP1.10 U$1.P10
INLA
  Top 0.305: IC2.38 45.85,22.57 45.34,23.08 45.34,33.31 51.56,39.53 JP1.7
  Top 0.61: U$1.P13 JP1.7
INLB
  Top 0.305: IC2.40 45.56,21.57 44.17,22.95 44.17,34.01 46.48,36.32 JP1.9
  Top 0.61: JP1.9 U$1.P11
INLC
  Top 0.305: IC2.42 45.26,20.57 43.01,22.83 43.01,34.14 43.79,34.92 43.79,44.6 JP1.11
  Top 0.61: U$1.P9 JP1.11
MODE
  Top 0.305: IC2.29 50.32,23.76 50.32,27.62 52.73,30.03 56.59,30.03 62.67,36.11 63.19,36.11 63.5,36.41 63.5,38.78 R4.2
N$2
  Top 0.305: CBOOT.1 41.52,21.22 41.91,20.83 43.68,20.83 44.93,19.57 IC2.44
N$13
  Top 0.305: IC2.4 48.28,11.5 C4.1
N$14
  Top 0.305: IC2.3 47.78,14.12 46.77,13.12 C4.2
NFAULT
  Top 0.305: IC2.28 50.78,27.43 52.92,29.57 58.21,29.57 R3.2 58.3,30.57 64.26,36.53 JP1.2
  Top 0.61: U$1.P18 JP1.2
OUTA  (via drill 0.25, 0.3)
  Top 0.305: IC2.9 50.78,15.25 58.04,7.98 60.07,7.98 60.64,8.55 72.3,8.55 73.02,9.27 76.07,9.27 76.2,9.14
  other vias: 77.98,12.19 77.98,9.65 79.5,12.19 79.5,8.38 79.5,9.65 79.5,10.92 77.98,10.92 77.98,8.38 74.55,12.07 75.82,10.79 75.82,12.07 74.55,10.79
  pour Top (no thermals): 82.6,15.11 80.59,13.1 80.54,13.08 76.2,13.08 76.2,3.94 82.5,3.94 89.92,11.36 89.92,15.11
  pour Bottom: 74.07,10.19 80.24,10.19 80.24,12.67 74.07,12.67
  pour Top: 74.07,9.8 76.56,9.8 76.56,13.06 74.07,13.06
  pour Bottom: 77.11,7.9 80.24,7.9 80.24,10.64 77.11,10.64
OUTB  (via drill 0.25, 0.3)
  Top 0.305: IC2.16 68.56,19.07 70.05,17.58 76.38,17.58
  other vias: 77.98,18.29 77.98,15.75 79.5,18.29 79.5,14.48 79.5,15.75 79.5,17.02 77.98,17.02 77.98,14.48 74.55,15.88 75.82,14.61 75.82,15.88 74.55,14.61
  pour Top (no thermals): 89.73,16.07 89.73,19.49 82.64,19.49 82.55,19.52 82.48,19.56 81.15,20.89 76.26,20.89 76.26,13.78 80.26,13.78 82.48,16 82.55,16.04 82.64,16.07
  pour Top: 74.19,13.61 76.81,13.61 76.81,16.87 74.19,16.87
  pour Bottom: 74.07,14 77.7,14 77.7,16.48 74.07,16.48
  pour Bottom: 76.99,16.15 80.24,16.15 80.24,18.9 76.99,18.9
  pour Bottom: 77.66,14 79.82,14 80.24,14.41 80.24,16.23 78.04,16.23 77.62,15.81 77.62,14.03
OUTC  (via drill 0.25, 0.3)  (23 unrouted)
  Top 0.305: 76.2,27.18 72.52,27.18 72.31,26.97 68.88,26.97 62.48,20.57 IC2.19
  other vias: 74.55,31.11 75.82,29.85 75.82,31.11 74.55,29.85 77.85,30.99 77.85,28.45 79.38,30.99 79.38,27.18 79.38,28.45 79.38,29.72 77.85,29.72 77.85,27.18 74.55,28.45 75.82,28.45
  pour Top (no thermals): 81.44,21.62 81.49,21.59 82.61,20.47 89.89,20.47 89.89,24.19 82.49,31.6 76.23,31.6 76.23,21.62
  pour Top: 74.1,27.84 76.56,27.84 76.56,31.6 74.07,31.6 74.07,27.88
  pour Bottom: 76.99,26.31 80.24,26.31 80.24,27.91 76.99,27.91
  pour Bottom: 74.07,27.97 80.24,27.97 80.24,31.72 74.07,31.72
RST  (via drill 0.35)
  Top 0.406: v16.84,75.64 7.68,66.48 J1.6
  Top 0.61: U$1.P35 JP2.16
  Bottom 0.305: U$1.P35 26.98,75.64 v16.84,75.64
SCL
  Top 0.406: U$1.P36 10.22,57.97 J1.5
  Top 0.61: U$1.P36 JP2.17
SDA
  Top 0.406: U$1.P33 12.76,52.89 J1.4
  Top 0.61: U$1.P33 JP2.14
SOA  (via drill 0.35)
  Top 0.305: IC2.25 54.26,25.7 55.66,25.7 55.9,25.46 v55.9,24.1
  Top 0.61: U$1.P3 JP1.17
  Bottom 0.305: v55.9,24.1 55.86,24.06 54,24.06 49.53,28.53 38.78,28.53 26.16,41.15 JP1.17
SOB  (via drill 0.35)
  Top 0.305: IC2.24 54.75,24.89 v54.99,24.89
  Top 0.61: U$1.P4 JP1.16
  Bottom 0.305: v54.99,24.89 50.9,28.98 40.63,28.98 28.7,40.91 JP1.16
SOC  (via drill 0.35)
  Top 0.305: IC2.23 56.1,22.57 57.15,23.62 v57.22,23.62
  Top 0.61: JP1.15 U$1.P5
  Bottom 0.305: v57.22,23.62 57.22,25.22 52.99,29.44 42.95,29.44 31.24,41.15 JP1.15
SPA
  Top 0.305: 71.37,10.79 70.18,9.6 60.91,9.6 60.26,10.26 57.79,10.26 51.78,16.27 IC2.11
  pour Top (no thermals): 71.92,10.92 71.98,10.95 73.51,10.95 73.51,12.51 72.71,13.31 68.86,13.31 68.86,9.84 68.9,9.8 70.8,9.8
SPB
  Top 0.305: 70.27,16.21 68.07,18.41 56.26,18.41 55.12,17.27 54.01,17.27 53.21,18.07 IC2.14
  pour Top (no thermals): 67.37,14.76 73.51,14.76 73.51,16.48 70.49,16.48 70.47,16.48 70.46,16.48 70.45,16.48 70.43,16.49 70.41,16.5 70.41,16.5 70.4,16.51 70.38,16.52 68.4,18.14 67.37,18.14
SPC
  Top 0.305: 72.3,29.27 71.55,28.52 67.05,28.52 60.14,21.61 52.97,21.61 IC2.21
  pour Top (no thermals): 68.99,28.6 73.51,28.6 73.51,31.56 72.96,32.11 68.99,32.11
  pour Top: 68.99,27.97 71.44,27.97 73.04,29.57 68.99,29.57
SW
  Top 0.305: CBOOT.2 39.37,22.47 41.52,20.32 43.41,20.32 44.66,19.07 IC2.45 | 23.21,23.5 CR1.1
  Top 0.508: 33.61,23.45 33.66,23.5 34.29,24.13
  Top 0.813: 33.66,23.5 23.21,23.5
  pour Top (no thermals): 35.94,23.66 36.01,23.62 37.72,21.91 39.81,21.91 39.81,25.72 32.96,25.72 32.96,23.69 35.86,23.69
VCC  (via drill 0.35)
  Top 0.305: 52.29,25.23 52.82,25.23 54.6,27.01 C6.1 57.56,27.01 R3.1 | 52.29,25.23 52.15,25.23 52.06,25.14 52.06,24.66 51.78,24.37 IC2.26 | 52.29,25.23 v52.07,25.02
  Top 0.813: J1.1 13.97,9.26 13.97,39.53 21.08,46.65 JP1.19 U$1.P1
  Bottom 0.305: v52.07,25.02 52.07,25.31 49.37,28.01 38.03,28.01 21.08,44.96 JP1.19
VCP
  Top 0.305: IC2.5 48.78,13.13 48.89,13.02 48.89,12.97 C5.2
VDS  (via drill 0.35)
  Top 0.305: IC2.31 49.28,28.45 v51.18,30.35 | v53.98,30.73 54.79,30.73 R5.2
  Bottom 0.305: v51.18,30.35 51.56,30.73 v53.98,30.73
VIN  (via drill 0.25, 0.3)
  Top 0.305: 42.04,15.24 41.91,15.24 | v71.88,23.11 72.14,23.11 72.39,22.86 | 72.46,20.39 72.34,20.52 71.43,20.52 71.31,20.41 v71.78,19.94
  other vias: 68.2,7.11 69.47,7.11 68.2,4.57 70.74,5.84 72.01,7.11 69.47,5.84 70.74,7.11 66.93,4.57 69.47,4.57 70.74,4.57 72.01,4.57 68.2,5.84 72.01,5.84 70.74,23.11 69.6,23.11 68.45,23.11 68.45,24.26 69.6,24.26 70.74,24.26 71.88,24.26 71.88,25.4 70.74,25.4 69.6,25.4 66.93,7.11 66.93,5.84 69.34,19.94 68.2,19.94 68.2,21.08 69.34,21.08 70.61,19.94 70.61,21.08 71.75,21.08 70.61,18.8 71.78,18.8 74.04,3.3 75.31,3.3 72.77,3.3 75.31,7.11 75.31,4.57 75.31,5.84 74.04,7.11 74.04,4.57 74.04,5.84 73.91,25.02 75.18,23.75 75.18,25.02 73.91,23.75 73.91,19.94 75.18,18.67 75.18,19.94 73.91,18.67
  pour Top (no thermals): 33.07,12.74 33.08,12.71 33.08,5.14 41.85,5.14 41.85,16.45 25.46,16.45 25.46,12.76 33.03,12.76 33.06,12.75
  pour Top (no thermals): 41.79,5.08 55.88,5.08 57.15,3.81 75.82,3.81 75.82,7.74 57.02,7.74 54.61,10.16 43.18,10.16 43.18,10.16 43.18,16.51 41.79,16.51
  pour Top (no thermals): 54.67,9.04 55.51,9.04 49.78,14.77 49.76,14.83 49.76,16.99 49.3,16.99 49.3,14.41
  pour Top (no thermals): 67.59,22.5 75.56,22.5 75.56,26.01 69.28,26.01 67.59,24.32
  pour Top (no thermals): 68.74,19.46 68.79,19.43 70.29,17.93 75.56,17.93 75.56,21.56 67.75,21.56 67.59,21.4 67.59,19.46
  pour Bottom: 67.44,7.79 67.4,7.74 67.34,7.72 58.57,7.72 58.57,3.96 72.49,3.96 72.49,26.26 68.39,26.26 67.46,25.34 67.46,7.84
  pour Top (no thermals): 42.06,15.65 43.03,15.65 43.03,16.29 43.05,16.34 44.24,17.53 44.29,17.55 46.2,17.55 46.2,18.14 43.88,18.14 42.06,16.32
  pour Bottom: 72.42,2.69 75.79,2.69 75.79,7.59 72.42,7.59
  pour Bottom: 72.29,22.76 75.77,22.76 75.77,26.26 72.29,26.26
  pour Top: 72.42,2.69 75.67,2.69 75.67,3.78 72.42,3.78
  pour Bottom: 72.42,17.93 75.69,17.93 75.69,20.29 72.42,20.29
VOUT  (via drill 0.35)
  Top 0.305: RFBT.2 39.37,18.09 v39.37,19.56
  Top 1.27: v42.55,35.56 35.6,35.56 L1.1 35.52,35.56 27.24,35.56 COUT2.1 COUT1.1 27.3,26.61 v27.3,24.86
  Bottom 0.305: v39.37,19.56 39.37,22.1 37.97,23.5 28.67,23.5 v27.3,24.86
  Bottom 1.27: v42.55,35.56 42.55,41.91 43.56,42.93 66.04,42.93 | 66.04,42.93 66.8,43.69 JP1.1 U$1.P19 | 66.04,42.93 69.85,42.93 80.88,42.93 X4.4

### Text on the board
tNames: HALL / SENSORS | C | ESP32 DEV / MODULE | B | A | + | - | BALANCING CUBE BLDC MOTOR DRIVER SHIELD / REV: 1.0 / OCTOBER 2022 | MOTOR | C | B | DRV8323RH | BNO055 / BREAKOUT | A | RST | SCL | SDA | GND | 3VO | VCC | POWER / SUPPLY | - | +
bNames: BALANCING CUBE BLDC MOTOR DRIVER SHIELD / REV: 1.0 / OCTOBER 2022